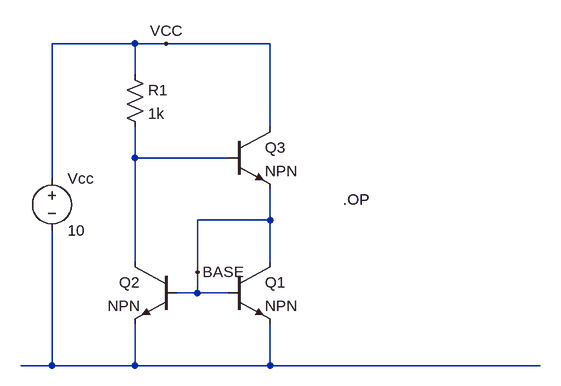
[diagram p0: schematic current_mirror.asc]
current_mirror.asc, the LTspice schematic file:
Version 4
SHEET 1 880 680
WIRE 208 48 80 48
WIRE 256 48 208 48
WIRE 416 48 256 48
WIRE 208 96 208 48
WIRE 416 176 416 48
WIRE 208 224 208 176
WIRE 256 224 208 224
WIRE 352 224 256 224
WIRE 80 256 80 48
WIRE 336 320 304 320
WIRE 416 320 416 272
WIRE 416 320 336 320
WIRE 208 384 208 224
WIRE 416 384 416 320
WIRE 304 400 304 320
WIRE 304 432 304 400
WIRE 304 432 272 432
WIRE 352 432 304 432
WIRE 80 544 80 336
WIRE 80 544 32 544
WIRE 208 544 208 480
WIRE 208 544 80 544
WIRE 416 544 416 480
WIRE 416 544 208 544
WIRE 832 544 416 544
FLAG 304 400 BASE
FLAG 256 48 VCC
DATAFLAG 336 320 "$"
DATAFLAG 256 224 "$"
SYMBOL npn 352 384 R0
SYMATTR InstName Q1
SYMBOL voltage 80 240 R0
SYMATTR InstName Vcc
SYMATTR Value 10
SYMBOL npn 272 384 M0
SYMATTR InstName Q2
SYMBOL npn 352 176 R0
SYMATTR InstName Q3
SYMBOL res 192 80 R0
SYMATTR InstName R1
SYMATTR Value 1k
TEXT 528 288 Left 2 !.OP

The netlist it stands for:
* current_mirror.asc
Q1 BASE BASE N002 0 NPN
Vcc VCC N002 10
Q2 N001 BASE N002 0 NPN
Q3 VCC N001 BASE 0 NPN
R1 VCC N001 1k
.model NPN NPN
.model PNP PNP
.lib standard.bjt
.OP
.backanno
.end